# EAGLE schematic Arduino UNO DRAM Tester (EAGLE 9.4.2)
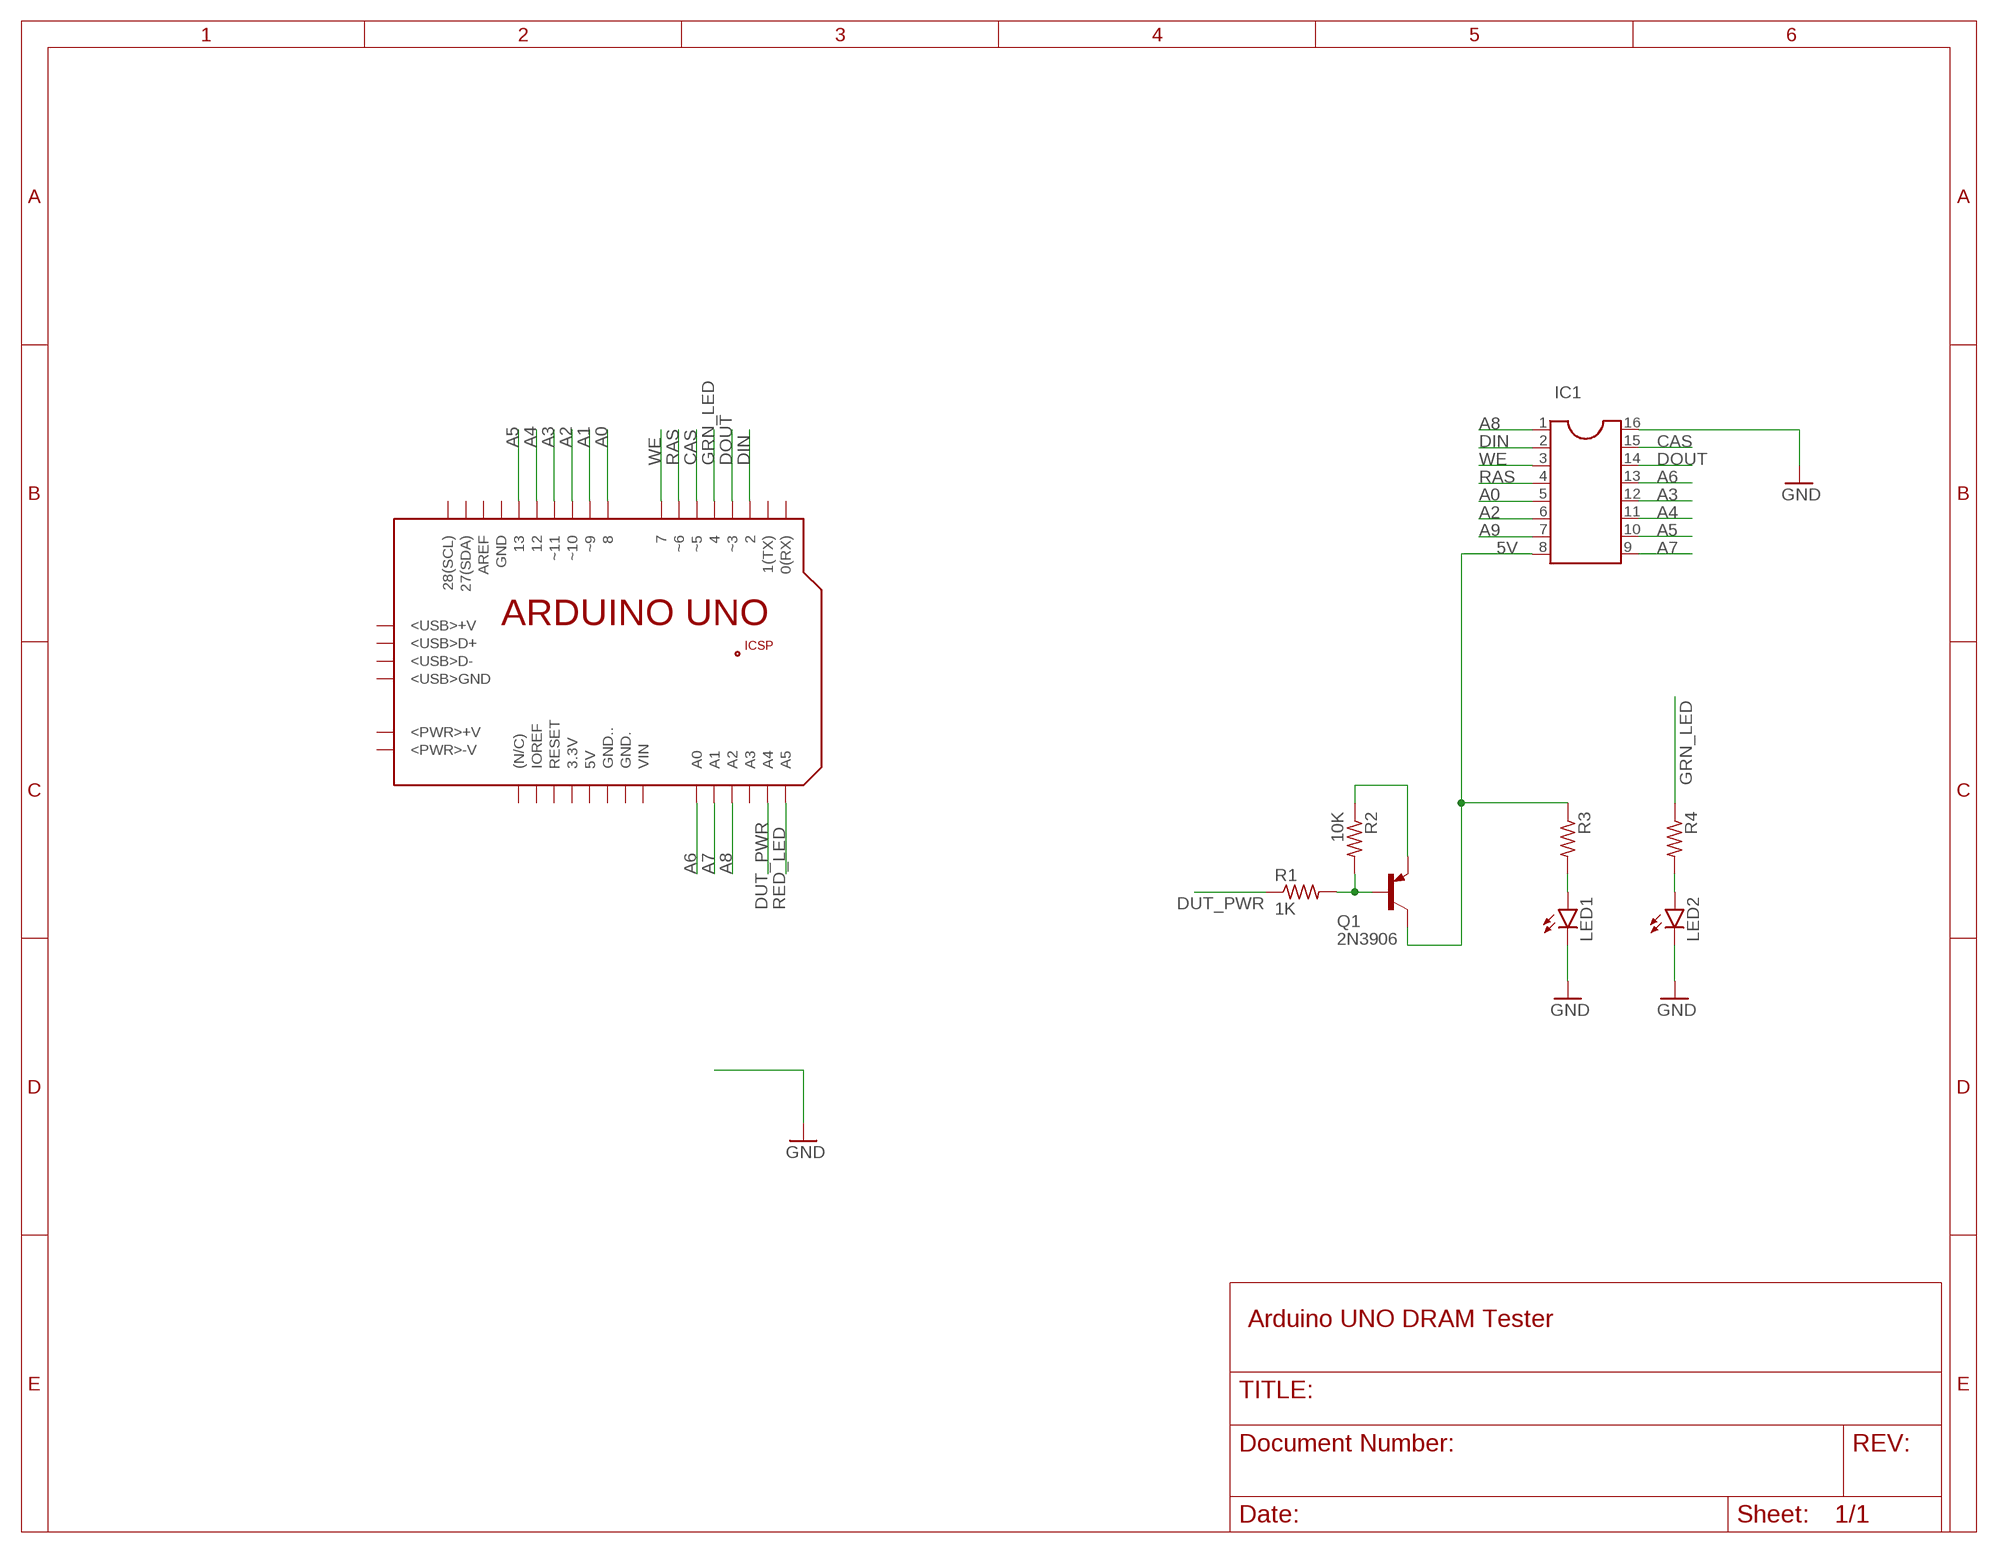
[diagram p0: schematic, sheet 1]

## Parts
IC1  DIL16  [DIL16]
LED1  LED5MM  [LED5MM]
LED2  LED5MM  [LED5MM]
PCB1  ARDUINO_UNO_EXT  (no package)
Q1  2N3906  [TO92]
R1  1K  R-US_0309/10  [0309/10]
R2  10K  R-US_0309/10  [0309/10]
R3  R-US_0309/10  [0309/10]
R4  R-US_0309/10  [0309/10]

## Nets
5V: IC1.8 Q1.1(C) R3.1
A0: IC1.5 PCB1.8
A1: PCB1.~9
A2: IC1.6 PCB1.~10
A3: IC1.12 PCB1.~11
A4: IC1.11 PCB1.12
A5: IC1.10 PCB1.13
A6: IC1.13 PCB1.A0
A7: IC1.9 PCB1.A1
A8: IC1.1 PCB1.A2
A9: IC1.7
CAS: IC1.15 PCB1.~5
DIN: IC1.2 PCB1.2
DOUT: IC1.14 PCB1.~3
DUT_PWR: PCB1.A4 R1.1
GND: IC1.16 LED1.K(C) LED2.K(C)
GRN_LED: PCB1.4 R4.1
N$6: LED1.A R3.2
N$7: Q1.2(B) R1.2 R2.2
N$17: Q1.3(E) R2.1
N$20: LED2.A R4.2
RAS: IC1.4 PCB1.~6
RED_LED: PCB1.A5
WE: IC1.3 PCB1.7
Unconnected: PCB1.0(RX) PCB1.1(TX) PCB1.3.3V PCB1.5V PCB1.27(SDA) PCB1.28(SCL) PCB1.(N/C) PCB1.+5V PCB1.<PWR>+V PCB1.<PWR>-V PCB1.<USB>+V PCB1.<USB>D+ PCB1.<USB>D- PCB1.<USB>GND PCB1.A3 PCB1.AREF PCB1.GND PCB1.GND. PCB1.GND.. PCB1.GND_ PCB1.IOREF PCB1.MISO PCB1.MOSI PCB1.RESET PCB1.RESET. PCB1.SCK PCB1.VIN

## Library data of the parts
IC1 = ic-package:DIL16: Dual In Line / Socket
LED1 LED2 = led:LED: LED OSRAM: - CHIPLED LG R971, LG N971, LY N971, LG Q971, LY Q971, LO R971, LY R971 LH N974, LH R974 LS Q976, LO Q976, LY Q976 LO Q996 - Hyper CHIPLED LW Q18S LB Q993, LB Q99A, LB R99A - SideLED LS A670, LO A670, LY A670, LG A670, LP A670 LB A673, LV A673, LT A673, LW A673 LH A674 LY A675 LS A676, LA A676, LO A676, LY A676, LW A676 LS A679, LY A679, LG A679 - Hyper Micro SIDELED® LS Y876, LA Y876, LO Y876, LY Y876 LT Y87S - SmartLED LW L88C, LW L88S LB L89C, LB L89S, LG L890 LS L89K, LO L89K, LY L89K LS L896, LA L896, LO L896, LY L896 - TOPLED LS T670, LO T670, LY T670, LG T670, LP T670 LSG T670, LSP T670, LSY T670, LOP T670, LYG T670 LG T671, LOG T671, LSG T671 LB T673, LV T673, LT T673, LW T673 LH T674 LS T676, LA T676, LO T676, LY T676, LB T676, LH T676, LSB T676, LW T676 LB T67C, LV T67C, LT T67C, LS T67K, LO T67K, LY T67K, LW E67C LS E67B, LA E67B, LO E67B, LY E67B, LB E67C, LV E67C, LT E67C LW T67C LS T679, LY T679, LG T679 LS T770, LO T770, LY T770, LG T770, LP T770 LB T773, LV T773, LT T773, LW T773 LH T774 LS E675, LA E675, LY E675, LS T675 LS T776, LA T776, LO T776, LY T776, LB T776 LHGB T686 LT T68C, LB T68C - Hyper Mini TOPLED® LB M676 - Mini TOPLED Santana® LG M470 LS M47K, LO M47K, LY M47K Source: http://www.osram.convergy.de LUXEON: - LUMILED® LXK2-PW12-R00, LXK2-PW12-S00, LXK2-PW14-U00, LXK2-PW14-V00 LXK2-PM12-R00, LXK2-PM12-S00, LXK2-PM14-U00 LXK2-PE12-Q00, LXK2-PE12-R00, LXK2-PE12-S00, LXK2-PE14-T00, LXK2-PE14-U00 LXK2-PB12-K00, LXK2-PB12-L00, LXK2-PB12-M00, LXK2-PB14-N00, LXK2-PB14-P00, LXK2-PB14-Q00 LXK2-PR12-L00, LXK2-PR12-M00, LXK2-PR14-Q00, LXK2-PR14-R00 LXK2-PD12-Q00, LXK2-PD12-R00, LXK2-PD12-S00 LXK2-PH12-R00, LXK2-PH12-S00 LXK2-PL12-P00, LXK2-PL12-Q00, LXK2-PL12-R00 Source: www.luxeon.com KINGBRIGHT: KA-3528ASYC Source: www.kingbright.com
PCB1 = E14_Arduino_revC:ARDUINO_UNO_EXT: Device for representing an Arduino Uno board in an EAGLE design without the PCB footprint. Created by Dave Young for Element14. More EAGLE documentation at: http://www.element14.com/community/community/knode/cadsoft_eagle
Q1 = transistor-pnp:2N3906: PNP Transistor
R1-R4 = resistor:R-US_: RESISTOR, American symbol